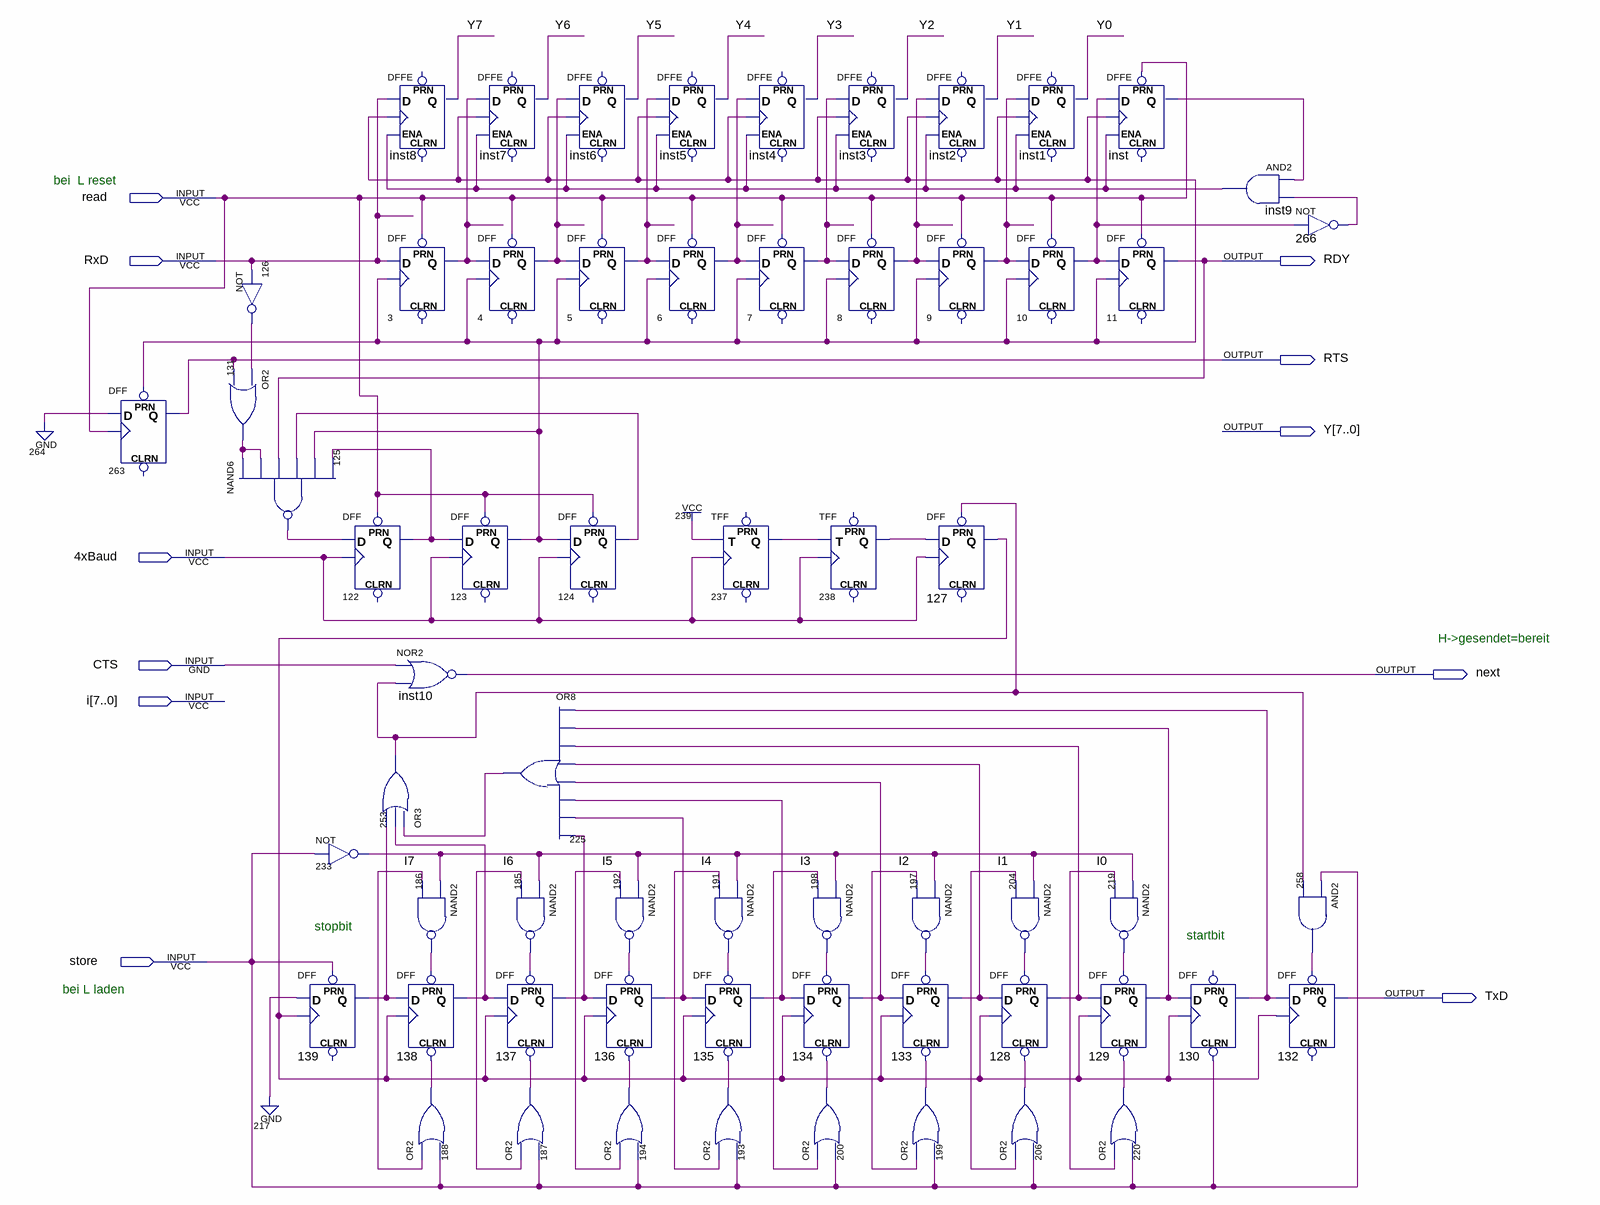
[diagram p0: schematic sheet]
// Quartus schematic RS232.bdf as structural Verilog: 62 symbols, 11 pins
module RS232 (
  input  read,
  input  RxD,
  input  \4xBaud ,
  input  CTS,
  input  [7:0] i,
  input  store,
  output RDY,
  output RTS,
  output [7:0] Y,
  output next,
  output TxD
);

  wire inst9_out, inst_q, n3_q, n4_q, n5_q, n6_q, n7_q, n8_q, n9_q, n10_q, n122_q, n123_q, n124_q, n125_out,
       n126_out, n127_q, n128_q, n129_q, n130_q, n131_out, n133_q, n134_q, n135_q, n136_q, n137_q, n138_q,
       n139_q, n185_out, n186_out, n187_out, n188_out, n191_out, n192_out, n193_out, n194_out, n197_out,
       n198_out, n199_out, n200_out, n204_out, n206_out, n219_out, n220_out, n225_out, n233_out, n237_q,
       n238_q, n253_out, n258_out, n266_out;

  DFF u_263 (.CLK(read), .D(1'b0), .PRN(n123_q), .Q(RTS));  // open: CLRN
  not u_126 (n126_out, RxD);
  or u_131 (n131_out, n126_out, RTS);
  nand u_125 (n125_out, n131_out, n131_out, RDY, n124_q, n123_q, n122_q);
  DFF u_122 (.CLK(\4xBaud ), .D(n125_out), .PRN(read), .Q(n122_q));  // open: CLRN
  not u_233 (n233_out, store);
  DFF u_139 (.CLK(n127_q), .D(1'b0), .PRN(store), .Q(n139_q));  // open: CLRN
  DFFE inst8 (.D(RxD), .CLK(n123_q), .ENA(inst9_out), .Q(Y[7]));  // open: PRN, CLRN
  DFF u_3 (.CLK(n123_q), .D(RxD), .PRN(read), .Q(n3_q));  // open: CLRN
  nor inst10 (next, CTS, n253_out);
  or u_253 (n253_out, n225_out, n138_q, n139_q);
  nand u_186 (n186_out, n233_out, i[7]);
  DFF u_138 (.CLRN(n188_out), .CLK(n127_q), .D(n139_q), .PRN(n186_out), .Q(n138_q));
  or u_188 (n188_out, i[7], store);
  DFFE inst7 (.D(n3_q), .CLK(n123_q), .ENA(inst9_out), .Q(Y[6]));  // open: PRN, CLRN
  DFF u_4 (.CLK(n123_q), .D(n3_q), .PRN(read), .Q(n4_q));  // open: CLRN
  DFF u_123 (.CLK(\4xBaud ), .D(n122_q), .PRN(read), .Q(n123_q));  // open: CLRN
  DFF u_124 (.CLK(\4xBaud ), .D(n123_q), .PRN(read), .Q(n124_q));  // open: CLRN
  or u_225 (n225_out, n130_q, n129_q, n128_q, n133_q, n134_q, n135_q, n136_q, n137_q);
  nand u_185 (n185_out, n233_out, i[6]);
  DFF u_137 (.CLRN(n187_out), .CLK(n127_q), .D(n138_q), .PRN(n185_out), .Q(n137_q));
  or u_187 (n187_out, i[6], store);
  DFFE inst6 (.D(n4_q), .CLK(n123_q), .ENA(inst9_out), .Q(Y[5]));  // open: PRN, CLRN
  DFF u_5 (.CLK(n123_q), .D(n4_q), .PRN(read), .Q(n5_q));  // open: CLRN
  nand u_192 (n192_out, n233_out, i[5]);
  DFF u_136 (.CLRN(n194_out), .CLK(n127_q), .D(n137_q), .PRN(n192_out), .Q(n136_q));
  or u_194 (n194_out, i[5], store);
  DFFE inst5 (.D(n5_q), .CLK(n123_q), .ENA(inst9_out), .Q(Y[4]));  // open: PRN, CLRN
  DFF u_6 (.CLK(n123_q), .D(n5_q), .PRN(read), .Q(n6_q));  // open: CLRN
  DFF u_135 (.CLRN(n193_out), .CLK(n127_q), .D(n136_q), .PRN(n191_out), .Q(n135_q));
  or u_193 (n193_out, i[4], store);
  DFFE inst4 (.D(n6_q), .CLK(n123_q), .ENA(inst9_out), .Q(Y[3]));  // open: PRN, CLRN
  DFF u_7 (.CLK(n123_q), .D(n6_q), .PRN(read), .Q(n7_q));  // open: CLRN
  TFF u_237 (.T(1'b1), .CLK(\4xBaud ), .Q(n237_q));  // open: PRN, CLRN
  nand u_191 (n191_out, n233_out, i[4]);
  DFFE inst3 (.D(n7_q), .CLK(n123_q), .ENA(inst9_out), .Q(Y[2]));  // open: PRN, CLRN
  DFF u_8 (.CLK(n123_q), .D(n7_q), .PRN(read), .Q(n8_q));  // open: CLRN
  TFF u_238 (.T(n237_q), .CLK(\4xBaud ), .Q(n238_q));  // open: PRN, CLRN
  nand u_198 (n198_out, n233_out, i[3]);
  DFF u_134 (.CLRN(n200_out), .CLK(n127_q), .D(n135_q), .PRN(n198_out), .Q(n134_q));
  or u_200 (n200_out, i[3], store);
  nand u_197 (n197_out, n233_out, i[2]);
  DFF u_133 (.CLRN(n199_out), .CLK(n127_q), .D(n134_q), .PRN(n197_out), .Q(n133_q));
  or u_199 (n199_out, i[2], store);
  DFFE inst2 (.D(n8_q), .CLK(n123_q), .ENA(inst9_out), .Q(Y[1]));  // open: PRN, CLRN
  DFF u_9 (.CLK(n123_q), .D(n8_q), .PRN(read), .Q(n9_q));  // open: CLRN
  DFF u_127 (.CLK(\4xBaud ), .D(n238_q), .PRN(n253_out), .Q(n127_q));  // open: CLRN
  DFF u_128 (.CLRN(n206_out), .CLK(n127_q), .D(n133_q), .PRN(n204_out), .Q(n128_q));
  DFFE inst1 (.D(n9_q), .CLK(n123_q), .ENA(inst9_out), .Q(Y[0]));  // open: PRN, CLRN
  DFF u_10 (.CLK(n123_q), .D(n9_q), .PRN(read), .Q(n10_q));  // open: CLRN
  nand u_204 (n204_out, n233_out, i[1]);
  or u_206 (n206_out, i[1], store);
  DFFE inst (.PRN(read), .D(n10_q), .CLK(n123_q), .ENA(inst9_out), .Q(inst_q));  // open: CLRN
  DFF u_11 (.CLK(n123_q), .D(n10_q), .PRN(read), .Q(RDY));  // open: CLRN
  nand u_219 (n219_out, n233_out, i[0]);
  DFF u_129 (.CLRN(n220_out), .CLK(n127_q), .D(n128_q), .PRN(n219_out), .Q(n129_q));
  or u_220 (n220_out, i[0], store);
  DFF u_130 (.CLRN(store), .CLK(n127_q), .D(n129_q), .Q(n130_q));  // open: PRN
  and inst9 (inst9_out, inst_q, n266_out);
  DFF u_132 (.CLK(n127_q), .D(n130_q), .PRN(n258_out), .Q(TxD));  // open: CLRN
  not u_266 (n266_out, n10_q);
  and u_258 (n258_out, store, n253_out);

  // Notes on the sheet:
  //   bei  L reset
  //   H->gesendet=bereit
  //   stopbit
  //   startbit
  //   bei L laden
endmodule
